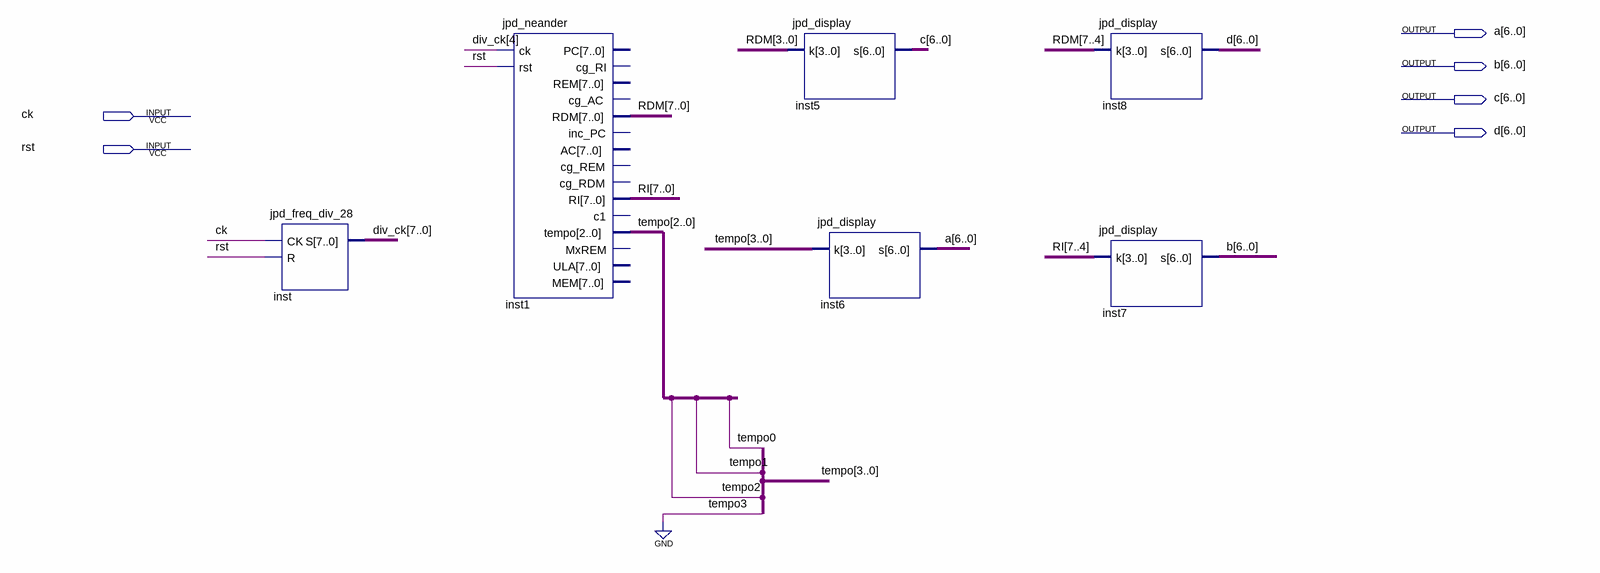
[diagram p0: schematic sheet]
// Quartus schematic jpd_neander_display.bdf as structural Verilog: 6 symbols, 6 pins
module jpd_neander_display (
  input  ck,
  input  rst,
  output [6:0] a,
  output [6:0] b,
  output [6:0] c,
  output [6:0] d
);

  wire [2:0] tempo;
  wire [7:0] div_ck, RDM, RI;

  jpd_freq_div_28 inst (.CK(ck), .R(rst), .S(div_ck));
  jpd_neander inst1 (
    .ck(div_ck[4]), .rst(rst), .RDM(RDM), .RI(RI), .tempo(tempo));  // open: PC, cg_RI, REM, cg_AC, inc_PC, AC, cg_REM, cg_RDM, c1, MxREM, ULA, MEM
  jpd_display inst5 (.k(RDM[3:0]), .s(c));
  jpd_display inst6 (.k({1'b0, tempo}), .s(a));
  jpd_display inst8 (.k(RDM[7:4]), .s(d));
  jpd_display inst7 (.k(RI[7:4]), .s(b));
endmodule
